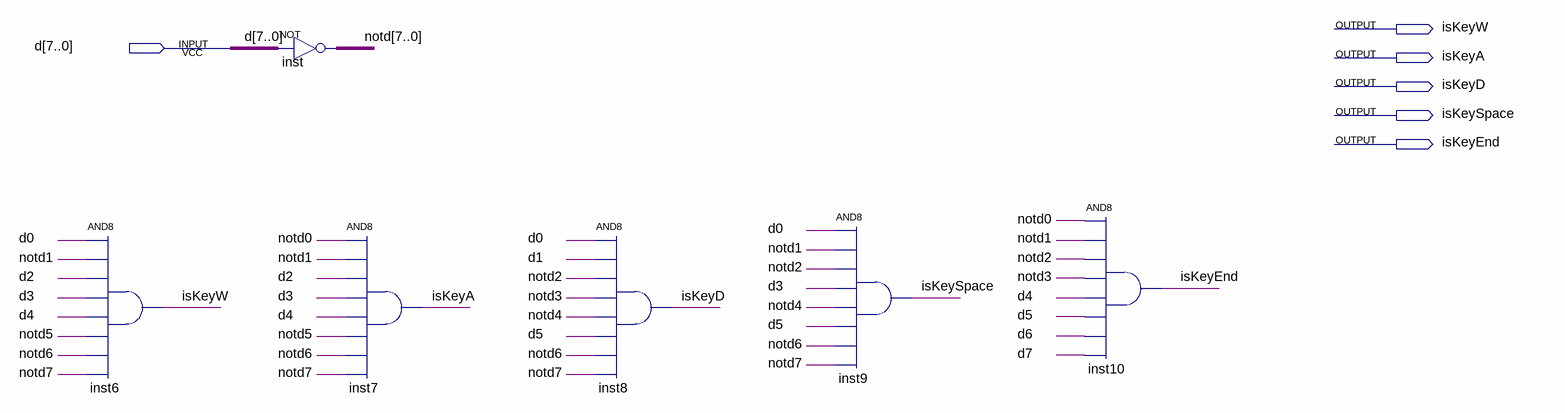
[diagram p0: schematic sheet]
// Quartus schematic KeyDetector.bdf as structural Verilog: 6 symbols, 6 pins
module KeyDetector (
  input  [7:0] d,
  output isKeyW,
  output isKeyA,
  output isKeyD,
  output isKeySpace,
  output isKeyEnd
);

  wire [7:0] notd;

  and inst6 (isKeyW, d[0], notd[1], d[2], d[3], d[4], notd[5], notd[6], notd[7]);
  assign notd = ~d;  // NOT inst, 8 bits wide
  and inst7 (isKeyA, notd[0], notd[1], d[2], d[3], d[4], notd[5], notd[6], notd[7]);
  and inst8 (isKeyD, d[0], d[1], notd[2], notd[3], notd[4], d[5], notd[6], notd[7]);
  and inst9 (isKeySpace, d[0], notd[1], notd[2], d[3], notd[4], d[5], notd[6], notd[7]);
  and inst10 (isKeyEnd, notd[0], notd[1], notd[2], notd[3], d[4], d[5], d[6], d[7]);
endmodule
